# Altium schematic sheet DDR_TERM_PWR.SchDoc
size A3
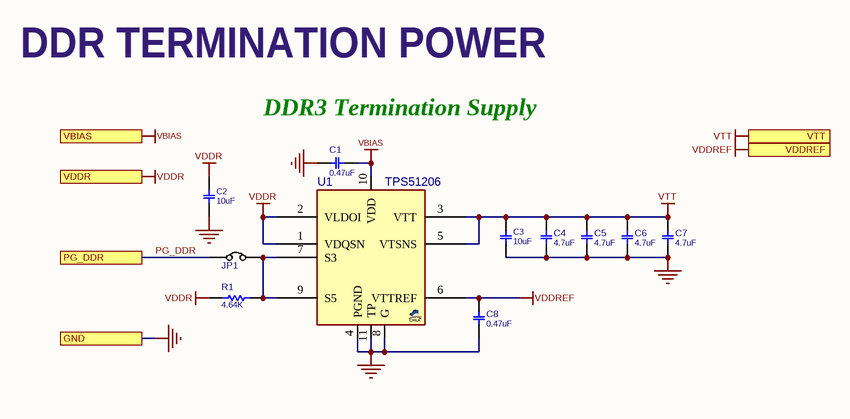
[diagram p0: DDR_TERM_PWR.SchDoc]

## Parts
C1  0.47uF  [C0402]
C2  10uF  [C0402]
C3  10uF  [C0402]
C4  4.7uF  [C0402]
C5  4.7uF  [C0402]
C6  4.7uF  [C0402]
C7  4.7uF  [C0402]
C8  0.47uF  [C0402]
JP1  JMPSOLDER  [JP_60X100]  (value not drawn)
R1  4.64K  [R0402]
U1  TPS51206  [SON40_10T_2020]

## Ports
GND, PG_DDR, VBIAS, VDDR, VDDREF, VTT

## Nets
GND: C1.2 C2.2 C3.2 C4.2 C5.2 C6.2 C7.2 C8.2 U1.4(PGND) U1.8(G) U1.11(TP) ; port GND
VBIAS: C1.1 U1.10(VDD) ; port VBIAS
VDDR: C2.1 R1.1 U1.1(VDQSN) U1.2(VLDOI) ; port VDDR
VDDREF: C8.1 U1.6(VTTREF) ; port VDDREF
VTT: C3.1 C4.1 C5.1 C6.1 C7.1 U1.3(VTT) U1.5(VTSNS) ; port VTT
PG_DDR: JP1.1 ; port PG_DDR
NetJP1_2: JP1.2 R1.2 U1.7(S3) U1.9(S5)

## Notes on the sheet
- DDR TERMINATION POWER
- (near C1) DDR3 Termination Supply
- Title
- Size:
- Date:
- File:
- A1
- Number:
- Time:
- Revision:
- Sheet
- of

## Library data of the parts
C1 C8 = CAP_SMD_MLCC_100n50V: CAP, MLCC, 100nF, 50V, X7S, 5%, 0402C; MANF_PART#: GRM155C71H104JE19D; MANF: Murata; PARAM2: X7R, 10%; PARAM: 50V; DESC: CAP, MLCC, 100nF, 50V, X7S, 5%, 0402C; ASSEMBLY: ASSEMBLY; PRICE: 100= 2$; VALUE: 0.47uF
C2 C3 = CAP_SMD_MLCC_100n50T: CAP, MLCC; PARAM: 6.3v; MANF: Taiyo Yuden; DESC: CAP, MLCC, 10uF, 6.3V, X5R, 10%, 0603C; PARAM2: X5R, 10%; MANF_P#: -; ASSEMBLY: ASSEMBLY; PRICE: 100= 5$; VALUE: 10uF
C4-C7 = CAP_SMD_MLCC_100n50V: CAP, MLCC; MANF_PART#: GRM155C71H104JE19D; PARAM: 50V; MANF: Murata; DESC: CAP, MLCC, 100nF, 50V, X7S, 5%, 0402C; PARAM2: X7R, 10%; ASSEMBLY: ASSEMBLY; PRICE: 100= 2$; VALUE: 4.7uF
JP1 = JUMPER_SOLDER: JUMPER, HEADER 2PIN; MANF: MANF; MANF_P#: MANF_P#; VALUE: JMPSOLDER
R1 = RES_SMD: RESISTOR, SMD, 10K, 1%, 0402; MANF: KOA SPEER; PARAM: 0.063W; DIST#: MOUSER; MANF_P#: RK73H1ETTP1002F; ASSEMBLY: ASSEMBLY; PRICE: 100= 0.5$; DESC: RESISTOR, SMD, 10K, 1%, 0402; PARAM2: 1%; VALUE: 4.64K
U1 = VREG_TPS51206_SON10: REG, Linear, LDO, 2A Sink/Source DDR Termination, SON-10; MANF: TI; DESC: REG, Linear, LDO, 3A Sink/Source DDR Termination, SON-10; PARAM2: 3.3/5Vcc,; MANF_P#: TPS51206DSQ; ASSEMBLY: ASSEMBLY; PARAM: 2A; PRICE: -; VALUE: TPS51206